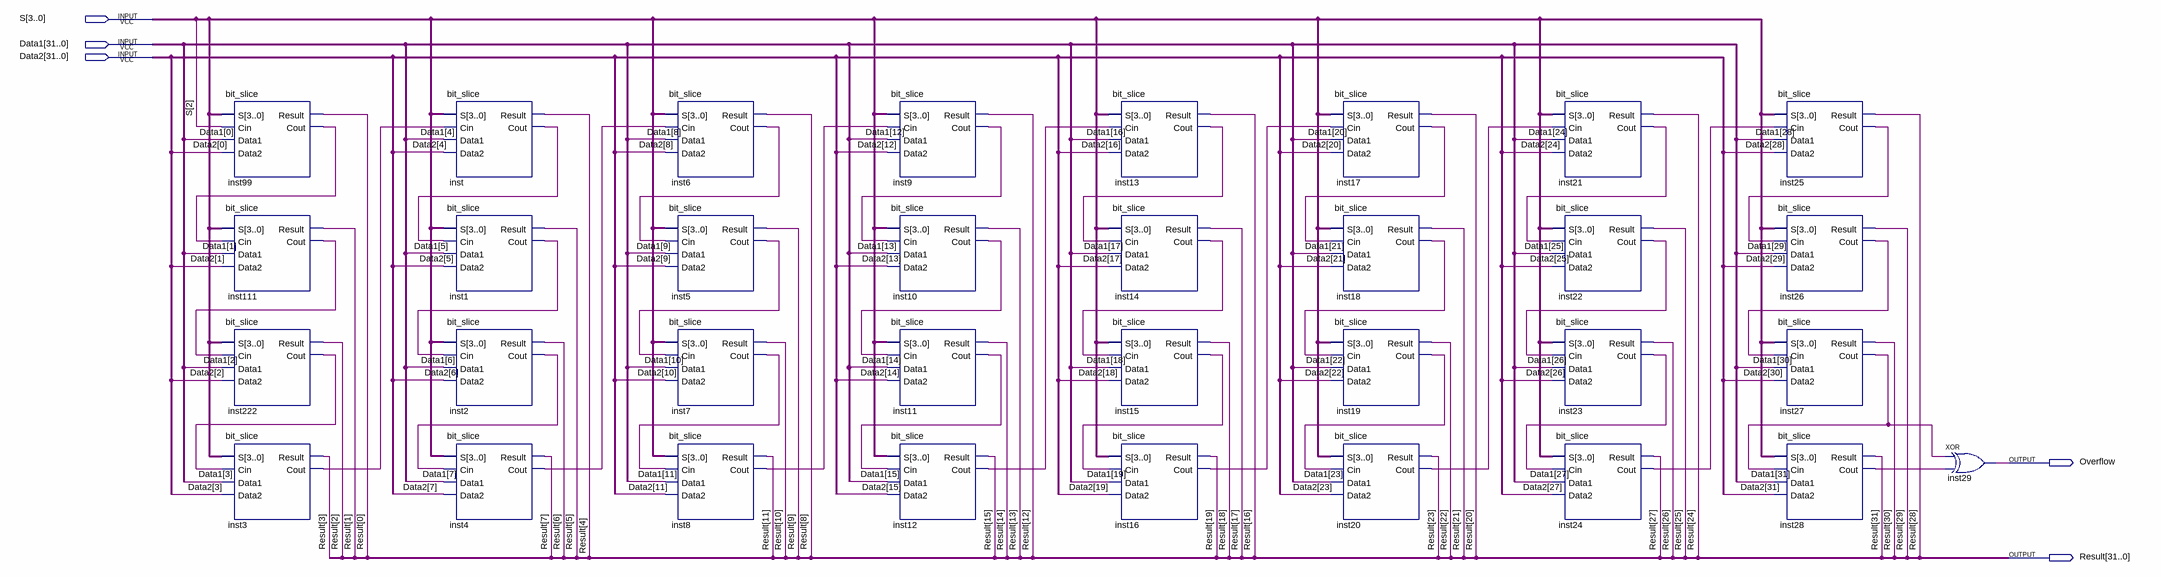
[diagram p0: schematic sheet]
// Quartus schematic bit_slice32.bdf as structural Verilog: 33 symbols, 5 pins
module bit_slice32 (
  input  [3:0] S,
  input  [31:0] Data1,
  input  [31:0] Data2,
  output Overflow,
  output [31:0] Result
);

  wire inst1_cout, inst2_cout, inst3_cout, inst4_cout, inst5_cout, inst6_cout, inst7_cout, inst8_cout,
       inst9_cout, inst10_cout, inst11_cout, inst12_cout, inst13_cout, inst14_cout, inst15_cout, inst16_cout,
       inst17_cout, inst18_cout, inst19_cout, inst20_cout, inst21_cout, inst22_cout, inst23_cout,
       inst24_cout, inst25_cout, inst26_cout, inst27_cout, inst28_cout, inst99_cout, inst111_cout,
       inst222_cout, inst_cout;

  bit_slice inst99 (.S(S), .Data1(Data1[0]), .Data2(Data2[0]), .Cin(S[2]), .Result(Result[0]), .Cout(inst99_cout));
  bit_slice inst111 (
    .S(S), .Data1(Data1[1]), .Data2(Data2[1]), .Cin(inst99_cout), .Result(Result[1]), .Cout(inst111_cout));
  bit_slice inst222 (
    .S(S), .Data1(Data1[2]), .Data2(Data2[2]), .Cin(inst111_cout), .Result(Result[2]), .Cout(inst222_cout));
  bit_slice inst3 (
    .S(S), .Data1(Data1[3]), .Data2(Data2[3]), .Cin(inst222_cout), .Result(Result[3]), .Cout(inst3_cout));
  bit_slice inst (.S(S), .Data1(Data1[4]), .Data2(Data2[4]), .Cin(inst3_cout), .Result(Result[4]), .Cout(inst_cout));
  bit_slice inst1 (.S(S), .Data1(Data1[5]), .Data2(Data2[5]), .Cin(inst_cout), .Result(Result[5]), .Cout(inst1_cout));
  bit_slice inst2 (.S(S), .Data1(Data1[6]), .Data2(Data2[6]), .Cin(inst1_cout), .Result(Result[6]), .Cout(inst2_cout));
  bit_slice inst4 (.S(S), .Data1(Data1[7]), .Data2(Data2[7]), .Cin(inst2_cout), .Result(Result[7]), .Cout(inst4_cout));
  bit_slice inst6 (.S(S), .Data1(Data1[8]), .Data2(Data2[8]), .Cin(inst4_cout), .Result(Result[8]), .Cout(inst6_cout));
  bit_slice inst5 (.S(S), .Data1(Data1[9]), .Data2(Data2[9]), .Cin(inst6_cout), .Result(Result[9]), .Cout(inst5_cout));
  bit_slice inst7 (
    .S(S), .Data1(Data1[10]), .Data2(Data2[10]), .Cin(inst5_cout), .Result(Result[10]), .Cout(inst7_cout));
  bit_slice inst8 (
    .S(S), .Data1(Data1[11]), .Data2(Data2[11]), .Cin(inst7_cout), .Result(Result[11]), .Cout(inst8_cout));
  bit_slice inst9 (
    .S(S), .Data1(Data1[12]), .Data2(Data2[12]), .Cin(inst8_cout), .Result(Result[12]), .Cout(inst9_cout));
  bit_slice inst10 (
    .S(S), .Data1(Data1[13]), .Data2(Data2[13]), .Cin(inst9_cout), .Result(Result[13]), .Cout(inst10_cout));
  bit_slice inst11 (
    .S(S), .Data1(Data1[14]), .Data2(Data2[14]), .Cin(inst10_cout), .Result(Result[14]), .Cout(inst11_cout));
  bit_slice inst12 (
    .S(S), .Data1(Data1[15]), .Data2(Data2[15]), .Cin(inst11_cout), .Result(Result[15]), .Cout(inst12_cout));
  bit_slice inst13 (
    .S(S), .Data1(Data1[16]), .Data2(Data2[16]), .Cin(inst12_cout), .Result(Result[16]), .Cout(inst13_cout));
  bit_slice inst14 (
    .S(S), .Data1(Data1[17]), .Data2(Data2[17]), .Cin(inst13_cout), .Result(Result[17]), .Cout(inst14_cout));
  bit_slice inst15 (
    .S(S), .Data1(Data1[18]), .Data2(Data2[18]), .Cin(inst14_cout), .Result(Result[18]), .Cout(inst15_cout));
  bit_slice inst16 (
    .S(S), .Data1(Data1[19]), .Data2(Data2[19]), .Cin(inst15_cout), .Result(Result[19]), .Cout(inst16_cout));
  bit_slice inst17 (
    .S(S), .Data1(Data1[20]), .Data2(Data2[20]), .Cin(inst16_cout), .Result(Result[20]), .Cout(inst17_cout));
  bit_slice inst18 (
    .S(S), .Data1(Data1[21]), .Data2(Data2[21]), .Cin(inst17_cout), .Result(Result[21]), .Cout(inst18_cout));
  bit_slice inst19 (
    .S(S), .Data1(Data1[22]), .Data2(Data2[22]), .Cin(inst18_cout), .Result(Result[22]), .Cout(inst19_cout));
  bit_slice inst20 (
    .S(S), .Data1(Data1[23]), .Data2(Data2[23]), .Cin(inst19_cout), .Result(Result[23]), .Cout(inst20_cout));
  bit_slice inst21 (
    .S(S), .Data1(Data1[24]), .Data2(Data2[24]), .Cin(inst20_cout), .Result(Result[24]), .Cout(inst21_cout));
  bit_slice inst22 (
    .S(S), .Data1(Data1[25]), .Data2(Data2[25]), .Cin(inst21_cout), .Result(Result[25]), .Cout(inst22_cout));
  bit_slice inst23 (
    .S(S), .Data1(Data1[26]), .Data2(Data2[26]), .Cin(inst22_cout), .Result(Result[26]), .Cout(inst23_cout));
  bit_slice inst24 (
    .S(S), .Data1(Data1[27]), .Data2(Data2[27]), .Cin(inst23_cout), .Result(Result[27]), .Cout(inst24_cout));
  bit_slice inst25 (
    .S(S), .Data1(Data1[28]), .Data2(Data2[28]), .Cin(inst24_cout), .Result(Result[28]), .Cout(inst25_cout));
  bit_slice inst26 (
    .S(S), .Data1(Data1[29]), .Data2(Data2[29]), .Cin(inst25_cout), .Result(Result[29]), .Cout(inst26_cout));
  bit_slice inst27 (
    .S(S), .Data1(Data1[30]), .Data2(Data2[30]), .Cin(inst26_cout), .Result(Result[30]), .Cout(inst27_cout));
  bit_slice inst28 (
    .S(S), .Data1(Data1[31]), .Data2(Data2[31]), .Cin(inst27_cout), .Result(Result[31]), .Cout(inst28_cout));
  xor inst29 (Overflow, inst27_cout, inst28_cout);
endmodule
